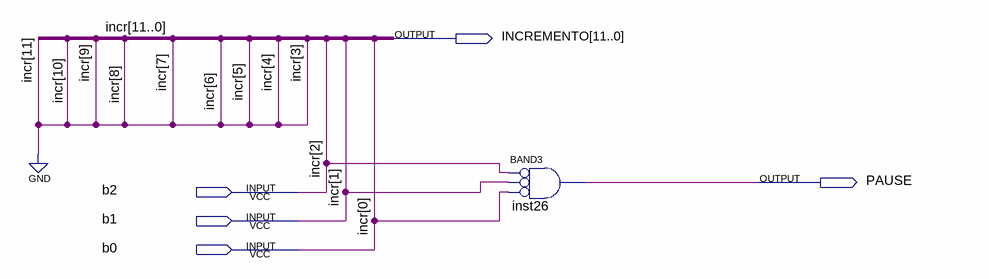
[diagram p0: schematic sheet]
// Quartus schematic incremento.bdf as structural Verilog: 1 symbols, 5 pins
module incremento (
  input  b2,
  input  b1,
  input  b0,
  output [11:0] INCREMENTO,
  output PAUSE
);

  and inst26 (PAUSE, ~b2, ~b1, ~b0);  // BAND3

  assign INCREMENTO = {{9{1'b0}}, b2, b1, b0};

  // Other names for the same wires on the sheet: incr[2:0] = {b2, b1, b0}
endmodule
